# Altium project Timingcard_PROJECT_v10.PrjPcb (part 4 of 4)
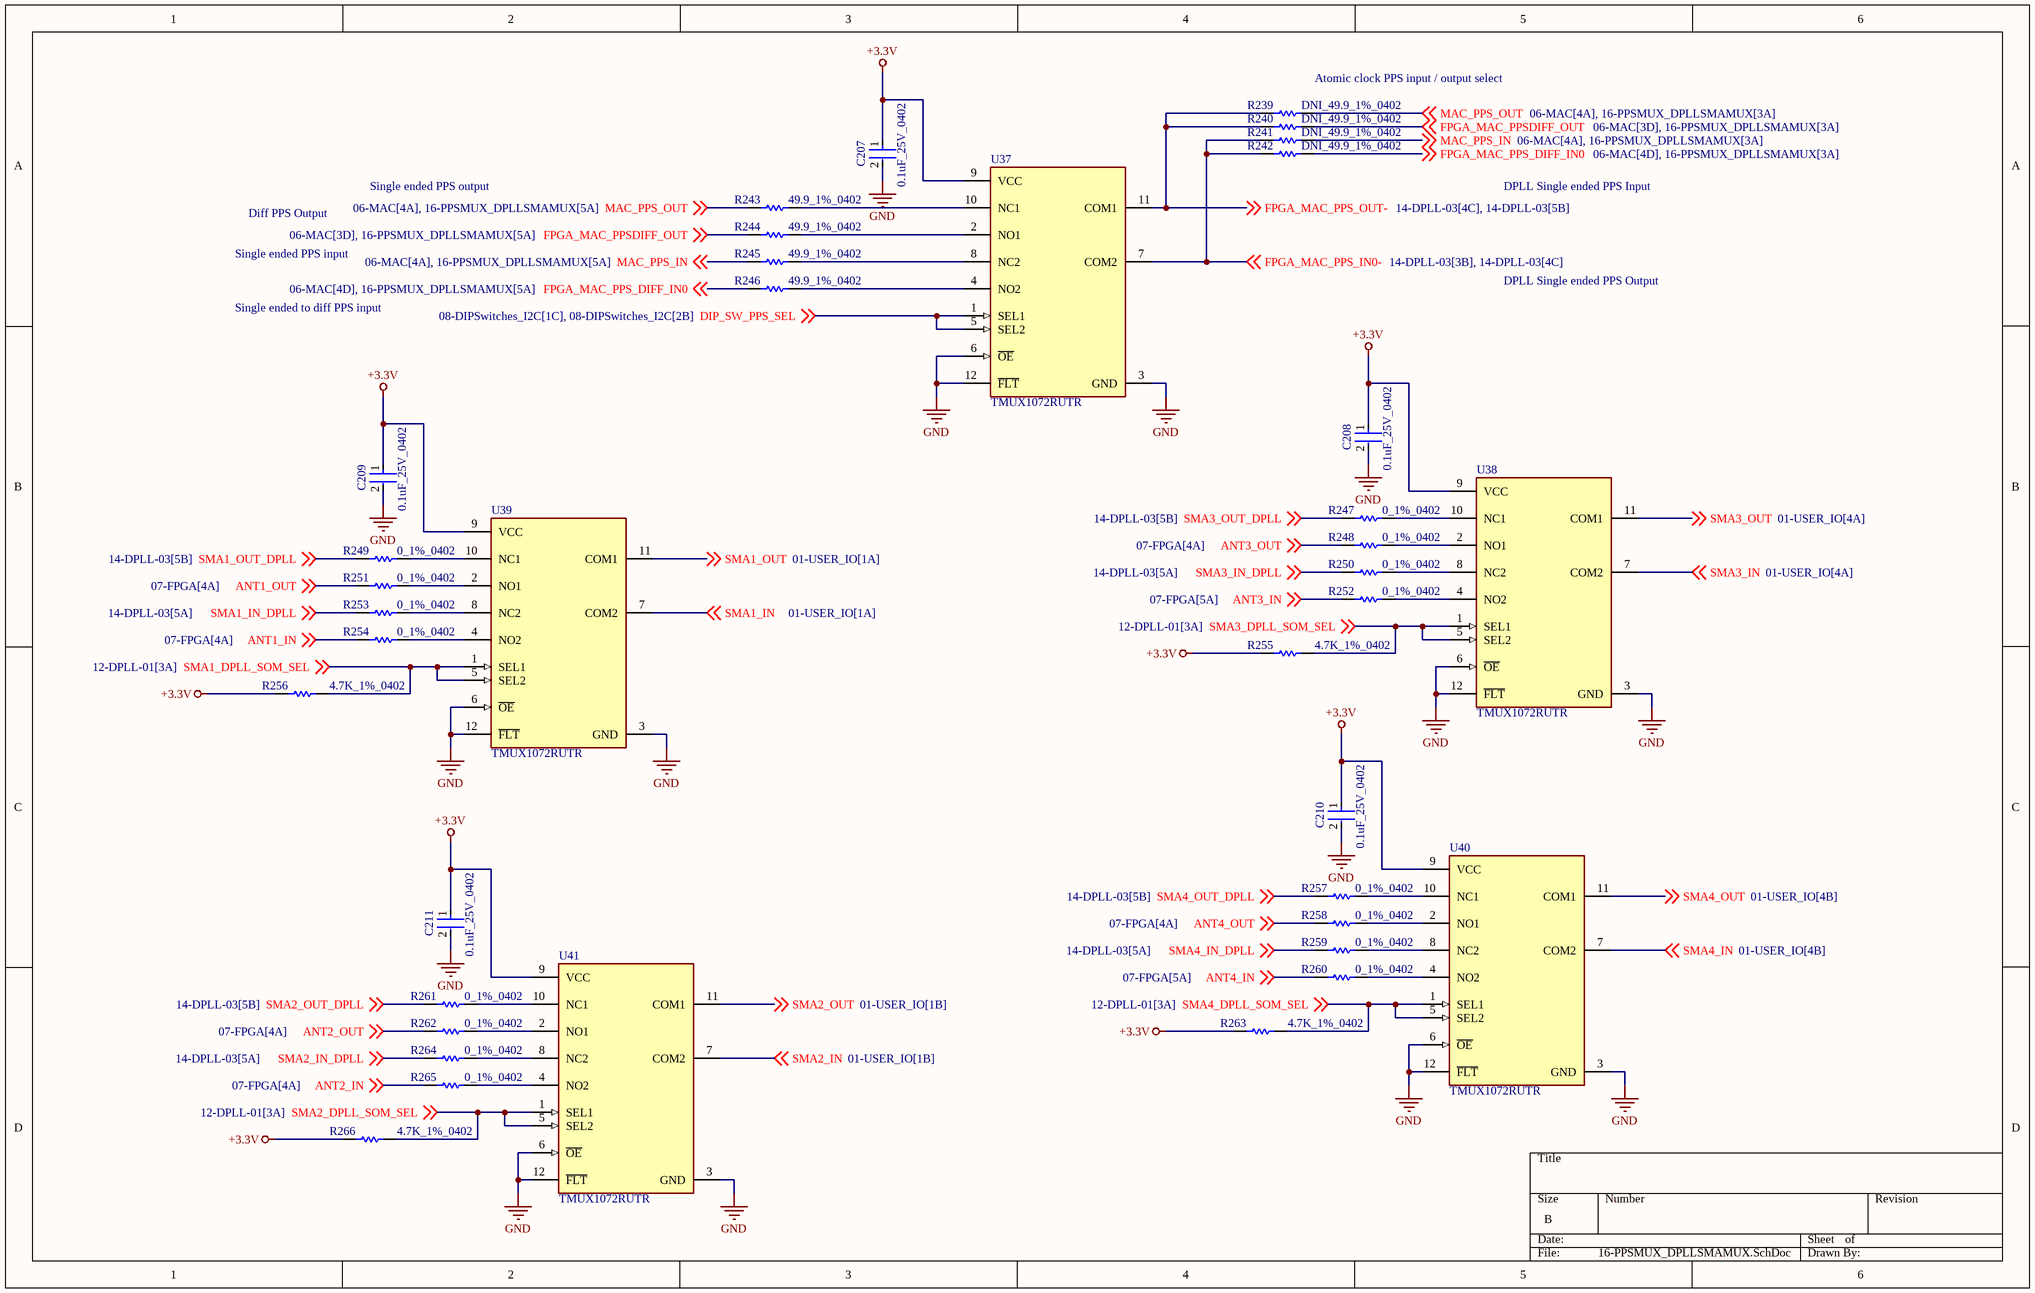
[diagram p14: 16-PPSMUX_DPLLSMAMUX.SchDoc]

## Nets that join several sheets
+3.3V: 01-USER_IO (18 pins), 02-USER_IO_STATUS (15 pins), 03-POWER (28 pins), 04-PCIe_JTAG (7 pins), 05-GPS_IMU_SENSORS (17 pins), 06-MAC (5 pins), 08-DIPSwitches_I2C (24 pins), 09-USBUart_PPSMUX_UARTMUX (5 pins), 11-M2_RCB_MUX (8 pins), 12-DPLL-01 (5 pins), 15-100M_ClkBuffer (16 pins), 16-PPSMUX_DPLLSMAMUX (14 pins)
+5.0V: 03-POWER (10 pins), 05-GPS_IMU_SENSORS (11 pins), 06-MAC (R45.2), 07-FPGA (8 pins), 09-USBUart_PPSMUX_UARTMUX (R180.2 U34.3 U34.5)
+12V: 03-POWER (24 pins), 06-MAC (R46.2)
+12V_PCIE: 03-POWER (CR1.3 R44.1), 04-PCIe_JTAG (5 pins)
GND: 01-USER_IO (34 pins), 02-USER_IO_STATUS (10 pins), 03-POWER (67 pins), 04-PCIe_JTAG (27 pins), 05-GPS_IMU_SENSORS (49 pins), 06-MAC (18 pins), 07-FPGA (56 pins), 08-DIPSwitches_I2C (16 pins), 09-USBUart_PPSMUX_UARTMUX (40 pins), 11-M2_RCB_MUX (14 pins), 12-DPLL-01 (11 pins), 15-100M_ClkBuffer (21 pins), 16-PPSMUX_DPLLSMAMUX (20 pins)
GNSS2_+3.3V: 05-GPS_IMU_SENSORS (7 pins), 09-USBUart_PPSMUX_UARTMUX (5 pins)
GNSS2_P5V0: 05-GPS_IMU_SENSORS (7 pins), 09-USBUart_PPSMUX_UARTMUX (C113.1 U34.2 U34.7)
ANT1_IN: 07-FPGA (J35.21), 16-PPSMUX_DPLLSMAMUX (R254.1)
ANT1_IO_IN: 01-USER_IO (R15.2 U8.7), 07-FPGA (J36.33)
ANT1_IO_OUT: 01-USER_IO (R14.2 U8.1), 07-FPGA (J36.31)
ANT1_OUT: 07-FPGA (J35.15), 16-PPSMUX_DPLLSMAMUX (R251.1)
ANT2_IN: 07-FPGA (J35.23), 16-PPSMUX_DPLLSMAMUX (R265.1)
ANT2_IO_IN: 01-USER_IO (R30.2 U12.7), 07-FPGA (J36.37)
ANT2_IO_OUT: 01-USER_IO (R29.2 U12.1), 07-FPGA (J36.35)
ANT2_OUT: 07-FPGA (J35.17), 16-PPSMUX_DPLLSMAMUX (R262.1)
ANT3_IN: 07-FPGA (J35.16), 16-PPSMUX_DPLLSMAMUX (R252.1)
ANT3_IO_IN: 01-USER_IO (R16.2 U11.7), 07-FPGA (J36.43)
ANT3_IO_OUT: 01-USER_IO (R17.2 U11.1), 07-FPGA (J36.41)
ANT3_OUT: 07-FPGA (J35.25), 16-PPSMUX_DPLLSMAMUX (R248.1)
ANT4_IN: 07-FPGA (J35.18), 16-PPSMUX_DPLLSMAMUX (R260.1)
ANT4_IO_IN: 01-USER_IO (R32.2 U16.7), 07-FPGA (J36.47)
ANT4_IO_OUT: 01-USER_IO (R31.2 U16.1), 07-FPGA (J36.45)
ANT4_OUT: 07-FPGA (J35.27), 16-PPSMUX_DPLLSMAMUX (R258.1)
BNO_INT: 05-GPS_IMU_SENSORS (R50.2 U13.14), 07-FPGA (J35.63)
DC_I2C_SCL: 05-GPS_IMU_SENSORS (P1.3 P5.3), 08-DIPSwitches_I2C (R114.1 U27.10)
DC_I2C_SDA: 05-GPS_IMU_SENSORS (P1.4 P5.4), 08-DIPSwitches_I2C (R113.1 U27.9)
DIP_SW_GPS1_SEL: 08-DIPSwitches_I2C (R141.2 R179.2 SW2.3), 11-M2_RCB_MUX (U29.2 U29.10 U31.1 U31.5)
DIP_SW_GPS2_SEL: 08-DIPSwitches_I2C (R140.2 R178.2 SW2.4), 11-M2_RCB_MUX (U28.2 U28.10 U30.1 U30.5)
DIP_SW_PPS_SEL: 08-DIPSwitches_I2C (R88.2 R122.2 SW1.7), 16-PPSMUX_DPLLSMAMUX (U37.1 U37.5)
DIP_SW_UART_SEL: 08-DIPSwitches_I2C (R78.2 R112.2 SW1.8), 09-USBUart_PPSMUX_UARTMUX (U21.1 U21.5 U22.1 U22.5)
EXT_EEPROM_WP: 05-GPS_IMU_SENSORS (R37.1 U7.5), 07-FPGA (J34.44)
FPGA_BNO_XIN32: 05-GPS_IMU_SENSORS (R71.2), 07-FPGA (J35.36)
FPGA_BNO_XOUT32: 05-GPS_IMU_SENSORS (R73.2), 07-FPGA (J35.38)
FPGA_MAC_PPS_DIFF_IN0: 06-MAC (R11.2 U3.3), 16-PPSMUX_DPLLSMAMUX (R242.2 R246.1)
FPGA_MAC_PPSDIFF_OUT: 06-MAC (U4.7), 16-PPSMUX_DPLLSMAMUX (R240.2 R244.1)
FPGA_MAC_UART_TX: 07-FPGA (J35.26), 08-DIPSwitches_I2C (R74.1 R94.1)
FPGA_TCK: 04-PCIe_JTAG (D5.3 R18.1), 07-FPGA (J36.77)
FPGA_TDI: 04-PCIe_JTAG (D8.3 R21.1), 07-FPGA (J36.78)
FPGA_TDO: 04-PCIe_JTAG (D6.3 R19.1), 07-FPGA (J36.79)
FPGA_TMS: 04-PCIe_JTAG (D7.3 R20.1), 07-FPGA (J36.80)
GPS1_PIN11: 07-FPGA (J35.4), 11-M2_RCB_MUX (R170.1 R172.1 R176.2)
GPS1_PIN12: 07-FPGA (J35.5), 11-M2_RCB_MUX (R173.1 R174.1 R177.2)
GPS1_PIN13: 05-GPS_IMU_SENSORS (J6.13), 07-FPGA (J35.2)
GPS1_PIN14: 05-GPS_IMU_SENSORS (J6.14), 07-FPGA (J35.3)
GPS1_PIN15: 05-GPS_IMU_SENSORS (J6.15), 07-FPGA (J35.1)
GPS1_RST: 05-GPS_IMU_SENSORS (J6.4 U9.4), 07-FPGA (J34.22)
GPS1_RX: 07-FPGA (J35.79), 11-M2_RCB_MUX (R152.2 R157.2 R163.2)
GPS1_TX: 07-FPGA (J35.80), 11-M2_RCB_MUX (R144.2 R155.2 R162.2)
GPS2_PIN11: 07-FPGA (J35.75), 11-M2_RCB_MUX (R166.1 R167.1 R171.2)
GPS2_PIN12: 07-FPGA (J35.76), 11-M2_RCB_MUX (R168.1 R169.1 R175.2)
GPS2_PIN13: 05-GPS_IMU_SENSORS (J13.13), 07-FPGA (J35.73)
GPS2_PIN14: 05-GPS_IMU_SENSORS (J13.14), 07-FPGA (J35.78)
GPS2_PIN15: 05-GPS_IMU_SENSORS (J13.15), 07-FPGA (J35.65)
GPS2_RST: 05-GPS_IMU_SENSORS (J13.4 U15.4), 07-FPGA (J36.11)
GPS2_RX: 09-USBUart_PPSMUX_UARTMUX (R103.2 U22.7), 11-M2_RCB_MUX (R146.2 R149.2 R156.2)
GPS2_RX_FPGA: 07-FPGA (J36.2), 09-USBUart_PPSMUX_UARTMUX (R93.1 R103.1)
GPS2_TX: 09-USBUart_PPSMUX_UARTMUX (R102.2 U22.11), 11-M2_RCB_MUX (R142.2 R148.2 R154.2)
GPS2_TX_FPGA: 07-FPGA (J36.1), 09-USBUart_PPSMUX_UARTMUX (R91.1 R102.1)
LED1: 02-USER_IO_STATUS (R35.1), 07-FPGA (J34.77)
LED2: 02-USER_IO_STATUS (R36.1), 07-FPGA (J34.75)
LED3: 02-USER_IO_STATUS (R38.1), 07-FPGA (J34.73)
LED4: 02-USER_IO_STATUS (R39.1), 07-FPGA (J34.71)
MAC_ALARM: 06-MAC (J31.20 U10.20), 07-FPGA (J35.35)
MAC_BITE: 06-MAC (SKT4.1 U10.P6), 07-FPGA (J35.37)
MAC_FPGA_UART_RX: 07-FPGA (J35.28), 08-DIPSwitches_I2C (R75.1 R111.1)
MAC_FREQ_CTRL: 05-GPS_IMU_SENSORS (R48.2 R186.2), 06-MAC (SKT2.1 U10.P1)
MAC_PPS_IN: 06-MAC (SKT8.1 U10.P9), 16-PPSMUX_DPLLSMAMUX (R241.2 R245.1)
MAC_PPS_OUT: 06-MAC (SKT10.1 U10.P10), 16-PPSMUX_DPLLSMAMUX (R239.2 R243.1)
MAC_RX: 06-MAC (SKT3.1 U10.P7), 08-DIPSwitches_I2C (R75.2 U26.7)
MAC_TX: 06-MAC (SKT1.1 U10.P8), 08-DIPSwitches_I2C (R74.2 U26.11)
MAC_USB+: 06-MAC (J31.2 U10.2), 07-FPGA (J35.72)
MAC_USB-: 06-MAC (J31.4 U10.4), 07-FPGA (J35.74)
MAC_USB_PWR: 06-MAC (J31.6 U10.6), 07-FPGA (J35.8)
PCIE_100M_CLK0_N: 07-FPGA (J37.38), 15-100M_ClkBuffer (C199.2)
PCIE_100M_CLK0_P: 07-FPGA (J37.36), 15-100M_ClkBuffer (C198.2)
PCIE_CLK_N: 04-PCIe_JTAG (C45.2), 15-100M_ClkBuffer (U36.15)
PCIE_CLK_P: 04-PCIe_JTAG (C44.2), 15-100M_ClkBuffer (U36.14)
PCIE_PERST: 04-PCIe_JTAG (P2.A11 R22.1), 05-GPS_IMU_SENSORS (R54.1), 07-FPGA (J36.21), 08-DIPSwitches_I2C (R121.1), 12-DPLL-01 (R105.1)
PCIE_RX0_N: 04-PCIe_JTAG (P2.B15), 07-FPGA (J37.37)
PCIE_RX0_P: 04-PCIe_JTAG (P2.B14), 07-FPGA (J37.35)
PCIE_RX1_N: 04-PCIe_JTAG (P2.B20), 07-FPGA (J37.32)
PCIE_RX1_P: 04-PCIe_JTAG (P2.B19), 07-FPGA (J37.30)
PCIE_RX2_N: 04-PCIe_JTAG (P2.B24), 07-FPGA (J37.20)
PCIE_RX2_P: 04-PCIe_JTAG (P2.B23), 07-FPGA (J37.18)
PCIE_RX3_N: 04-PCIe_JTAG (P2.B28), 07-FPGA (J37.25)
PCIE_RX3_P: 04-PCIe_JTAG (P2.B27), 07-FPGA (J37.23)
PCIE_TX0_N: 04-PCIe_JTAG (C47.2), 07-FPGA (J37.31)
PCIE_TX0_P: 04-PCIe_JTAG (C46.2), 07-FPGA (J37.29)
PCIE_TX1_N: 04-PCIe_JTAG (C49.2), 07-FPGA (J37.26)
PCIE_TX1_P: 04-PCIe_JTAG (C48.2), 07-FPGA (J37.24)
PCIE_TX2_N: 04-PCIe_JTAG (C51.2), 07-FPGA (J37.14)
PCIE_TX2_P: 04-PCIe_JTAG (C50.2), 07-FPGA (J37.12)
PCIE_TX3_N: 04-PCIe_JTAG (C53.2), 07-FPGA (J37.19)
PCIE_TX3_P: 04-PCIe_JTAG (C52.2), 07-FPGA (J37.17)
RCB_GPS1_PIN11: 05-GPS_IMU_SENSORS (J6.11), 11-M2_RCB_MUX (R170.2 U31.10)
RCB_GPS1_PIN12: 05-GPS_IMU_SENSORS (J6.12), 11-M2_RCB_MUX (R173.2 U31.8)
RCB_GPS1_RX: 05-GPS_IMU_SENSORS (J6.5 U9.5), 11-M2_RCB_MUX (R157.1 U29.5)
RCB_GPS1_TP1: 05-GPS_IMU_SENSORS (J6.6 U9.6), 11-M2_RCB_MUX (R159.1 U29.9)
RCB_GPS1_TP2: 05-GPS_IMU_SENSORS (J6.7 U9.7), 11-M2_RCB_MUX (R161.1 U29.13)
RCB_GPS1_TX: 05-GPS_IMU_SENSORS (J6.3 U9.3), 11-M2_RCB_MUX (R155.1 U29.1)
RCB_GPS2_PIN11: 05-GPS_IMU_SENSORS (J13.11), 11-M2_RCB_MUX (R166.2 U30.10)
RCB_GPS2_PIN12: 05-GPS_IMU_SENSORS (J13.12), 11-M2_RCB_MUX (R168.2 U30.8)
RCB_GPS2_RX: 05-GPS_IMU_SENSORS (J13.5 U15.5), 11-M2_RCB_MUX (R149.1 U28.5)
RCB_GPS2_TP1: 05-GPS_IMU_SENSORS (J13.6 U15.6), 11-M2_RCB_MUX (R151.1 U28.9)
RCB_GPS2_TP2: 05-GPS_IMU_SENSORS (J13.7 U15.7), 11-M2_RCB_MUX (R153.1 U28.13)
RCB_GPS2_TX: 05-GPS_IMU_SENSORS (J13.3 U15.3), 11-M2_RCB_MUX (R148.1 U28.1)
SCL: 05-GPS_IMU_SENSORS (U7.1), 07-FPGA (J35.67), 08-DIPSwitches_I2C (R124.1 U27.12)
SDA: 05-GPS_IMU_SENSORS (U7.3), 07-FPGA (J35.61), 08-DIPSwitches_I2C (R123.1 U27.13)
SENS_I2C_SCL: 02-USER_IO_STATUS (U6.7), 03-POWER (U2.4 U17.4 U19.4), 05-GPS_IMU_SENSORS (U13.19 U14.4), 08-DIPSwitches_I2C (R118.1 U27.5)
SENS_I2C_SDA: 02-USER_IO_STATUS (U6.6), 03-POWER (U2.3 U17.3 U19.3), 05-GPS_IMU_SENSORS (U13.20 U14.3), 08-DIPSwitches_I2C (R117.1 U27.4)
SMA1_DPLL_SOM_SEL: 12-DPLL-01 (U23.64), 16-PPSMUX_DPLLSMAMUX (R256.1 U39.1 U39.5)
SMA1_IN: 01-USER_IO (U8.3), 16-PPSMUX_DPLLSMAMUX (U39.7)
SMA1_OUT: 01-USER_IO (U8.2), 16-PPSMUX_DPLLSMAMUX (U39.11)
SMA2_DPLL_SOM_SEL: 12-DPLL-01 (U23.47), 16-PPSMUX_DPLLSMAMUX (R266.1 U41.1 U41.5)
SMA2_IN: 01-USER_IO (U12.3), 16-PPSMUX_DPLLSMAMUX (U41.7)
SMA2_OUT: 01-USER_IO (U12.2), 16-PPSMUX_DPLLSMAMUX (U41.11)
SMA3_DPLL_SOM_SEL: 12-DPLL-01 (U23.45), 16-PPSMUX_DPLLSMAMUX (R255.1 U38.1 U38.5)
SMA3_IN: 01-USER_IO (U11.3), 16-PPSMUX_DPLLSMAMUX (U38.7)
SMA3_OUT: 01-USER_IO (U11.2), 16-PPSMUX_DPLLSMAMUX (U38.11)
SMA4_DPLL_SOM_SEL: 12-DPLL-01 (U23.28), 16-PPSMUX_DPLLSMAMUX (R263.1 U40.1 U40.5)
SMA4_IN: 01-USER_IO (U16.3), 16-PPSMUX_DPLLSMAMUX (U40.7)
SMA4_OUT: 01-USER_IO (U16.2), 16-PPSMUX_DPLLSMAMUX (U40.11)
UART1_RXD: 07-FPGA (J35.77), 09-USBUart_PPSMUX_UARTMUX (R101.2 U21.7)
UART1_TXD: 07-FPGA (J35.71), 09-USBUart_PPSMUX_UARTMUX (R100.2 U21.11)